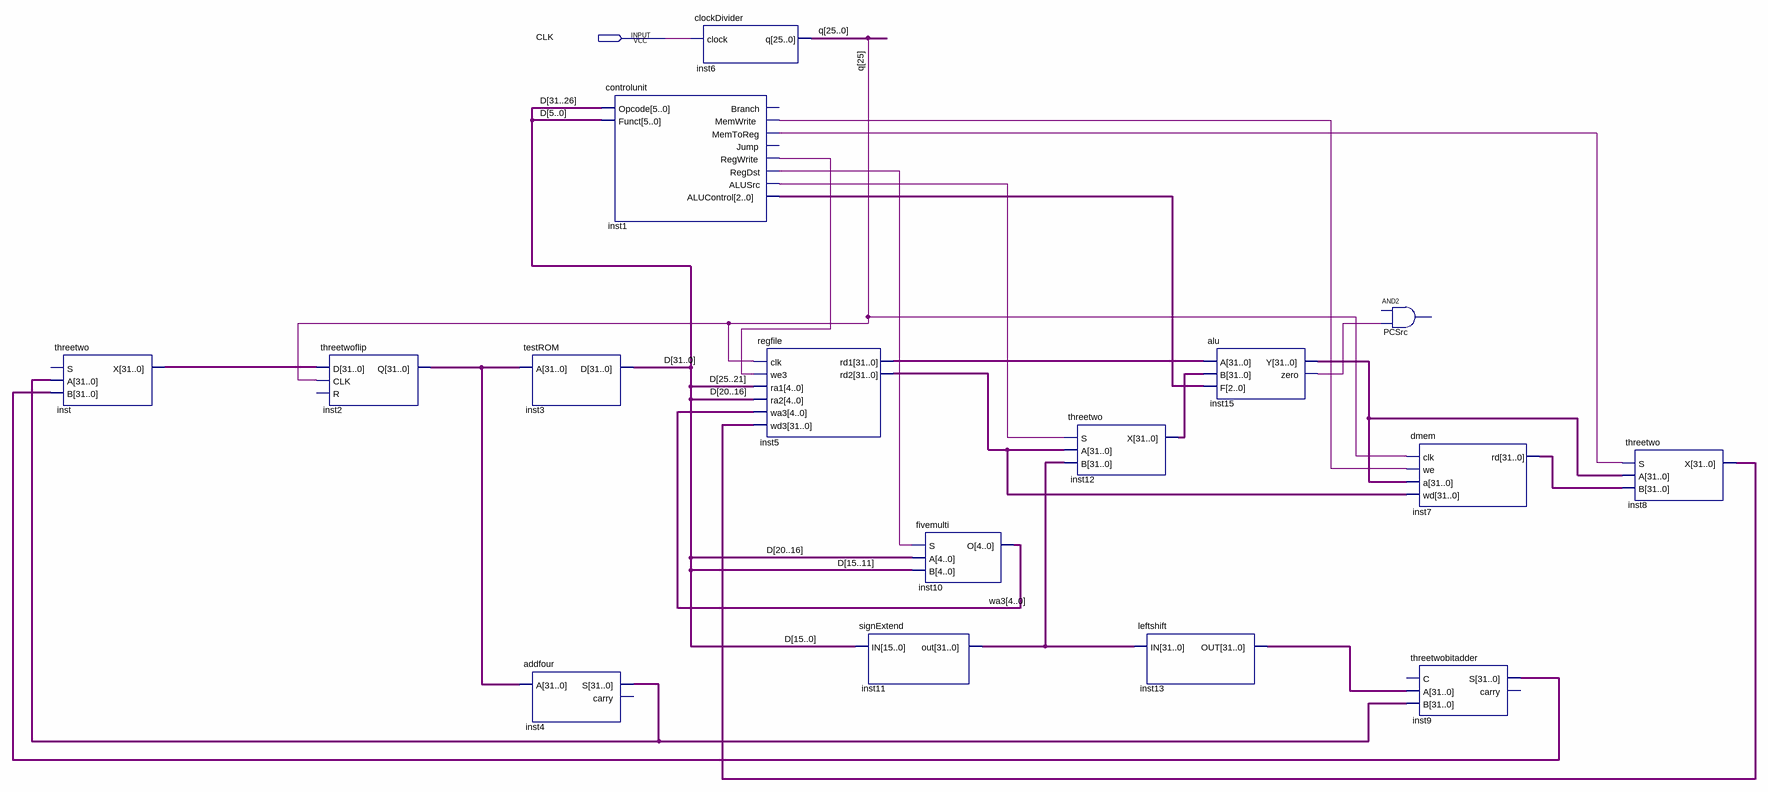
[diagram p0: schematic sheet]
// Quartus schematic processor.bdf as structural Verilog: 16 symbols, 1 pins
module processor (
  input  CLK
);

  wire inst1_alusrc, inst1_memtoreg, inst1_memwrite, inst1_regdst, inst1_regwrite, inst15_zero;
  wire [2:0] inst1_alucontrol;
  wire [4:0] wa3;
  wire [25:0] q;
  wire [31:0] D, inst2_q, inst4_s, inst5_rd1, inst5_rd2, inst7_rd, inst8_x, inst9_s, inst11_out, inst12_x,
       inst13_out, inst15_y, inst_x;

  threetwo inst (.A(inst4_s), .B(inst9_s), .X(inst_x));  // open: S
  threetwoflip inst2 (.D(inst_x), .CLK(q[25]), .Q(inst2_q));  // open: R
  testROM inst3 (.A(inst2_q), .D(D));
  addfour inst4 (.A(inst2_q), .S(inst4_s));  // open: carry
  controlunit inst1 (
    .Opcode(D[31:26]), .Funct(D[5:0]), .MemWrite(inst1_memwrite), .MemToReg(inst1_memtoreg),
    .RegWrite(inst1_regwrite), .RegDst(inst1_regdst), .ALUSrc(inst1_alusrc), .ALUControl(inst1_alucontrol));  // open: Branch, Jump
  clockDivider inst6 (.clock(CLK), .q(q));
  regfile inst5 (
    .clk(q[25]), .we3(inst1_regwrite), .ra1(D[25:21]), .ra2(D[20:16]), .wa3(wa3), .wd3(inst8_x),
    .rd1(inst5_rd1), .rd2(inst5_rd2));
  signExtend inst11 (.IN(D[15:0]), .out(inst11_out));
  fivemulti inst10 (.S(inst1_regdst), .A(D[20:16]), .B(D[15:11]), .O(wa3));
  threetwo inst12 (.S(inst1_alusrc), .A(inst5_rd2), .B(inst11_out), .X(inst12_x));
  leftshift inst13 (.IN(inst11_out), .OUT(inst13_out));
  alu inst15 (.A(inst5_rd1), .B(inst12_x), .F(inst1_alucontrol), .Y(inst15_y), .zero(inst15_zero));
  // AND2 PCSrc has open pins: IN1=open, IN2=inst15_zero, OUT=open
  dmem inst7 (.clk(q[25]), .we(inst1_memwrite), .a(inst15_y), .wd(inst5_rd2), .rd(inst7_rd));
  threetwobitadder inst9 (.A(inst13_out), .B(inst4_s), .S(inst9_s));  // open: C, carry
  threetwo inst8 (.S(inst1_memtoreg), .A(inst15_y), .B(inst7_rd), .X(inst8_x));
endmodule
